# EAGLE schematic Sensor_Stick_half_hw (EAGLE 9.6.2)
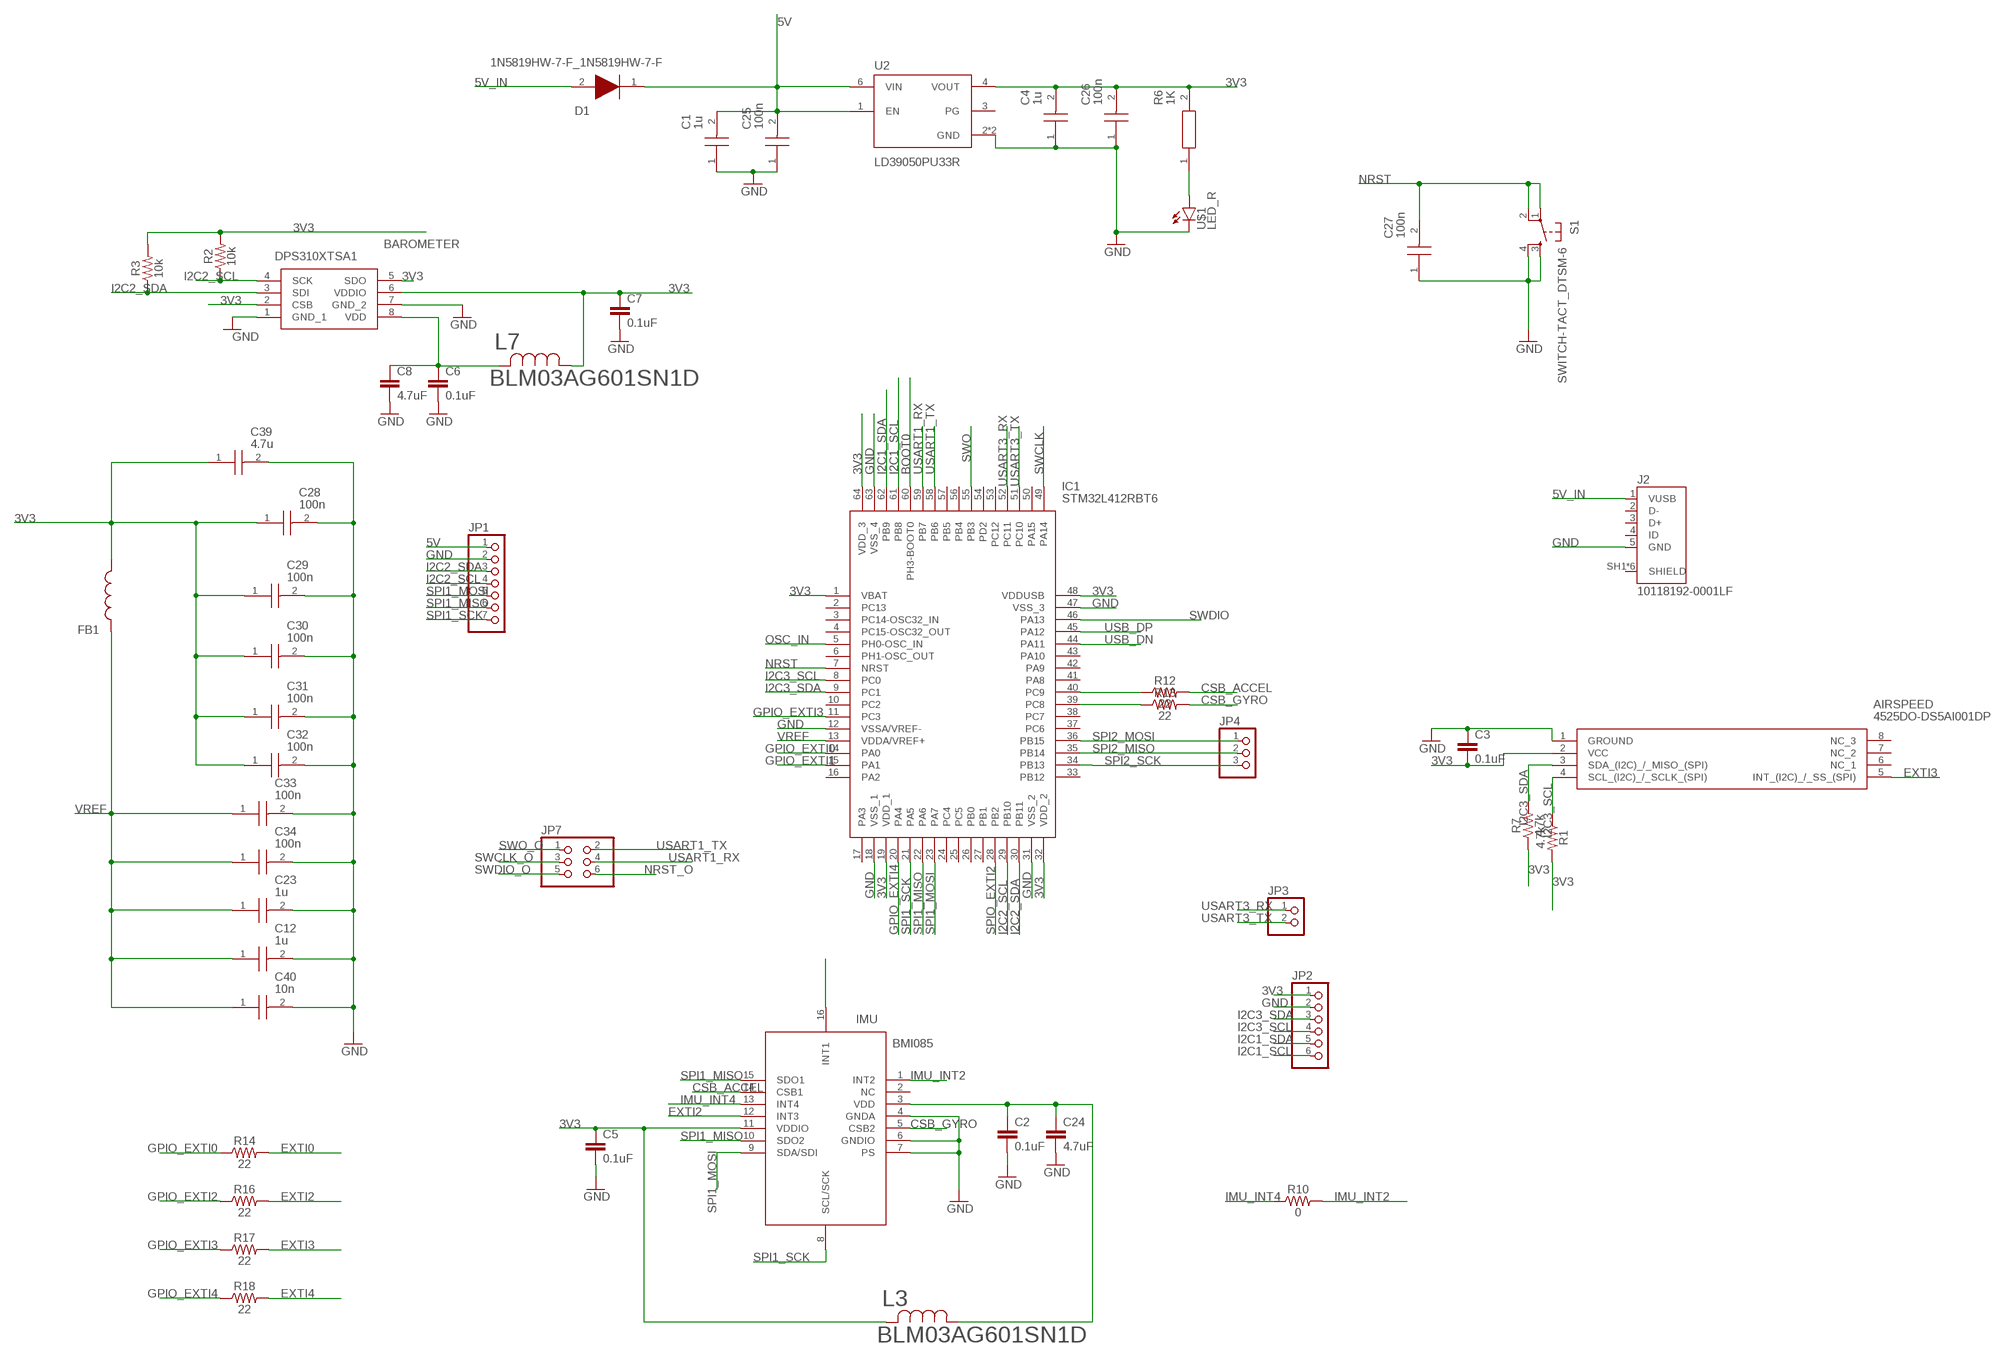
[diagram p0: schematic, sheet 1]

## Parts
AIRSPEED  4525DO-DS5AI001DP  [4525DO-DS...P]
BAROMETER  DPS310XTSA1  [DPS310XTSA1]
C1  1u  GRM219R61H105KA73D  [CAPC2012X95N]
C2  0.1uF  0.1UF-0402-6.3V-10%-X7R  [0402]
C3  0.1uF  0.1UF-0402-6.3V-10%-X7R  [0402]
C4  1u  GRM219R61H105KA73D  [CAPC2012X95N]
C5  0.1uF  0.1UF-0402-6.3V-10%-X7R  [0402]
C6  0.1uF  0.1UF-0402-6.3V-10%-X7R  [0402]
C7  0.1uF  0.1UF-0402-6.3V-10%-X7R  [0402]
C8  4.7uF  4.7UF0603  [0603]
C12  1u  GRM219R61H105KA73D  [CAPC2012X95N]
C23  1u  GRM219R61H105KA73D  [CAPC2012X95N]
C24  4.7uF  4.7UF0603  [0603]
C25  100n  GRT31C5C2A104JA12L  [CAPC3216X180N]
C26  100n  GRT31C5C2A104JA12L  [CAPC3216X180N]
C27  100n  GRT31C5C2A104JA12L  [CAPC3216X180N]
C28  100n  GRT31C5C2A104JA12L  [CAPC3216X180N]
C29  100n  GRT31C5C2A104JA12L  [CAPC3216X180N]
C30  100n  GRT31C5C2A104JA12L  [CAPC3216X180N]
C31  100n  GRT31C5C2A104JA12L  [CAPC3216X180N]
C32  100n  GRT31C5C2A104JA12L  [CAPC3216X180N]
C33  100n  GRT31C5C2A104JA12L  [CAPC3216X180N]
C34  100n  GRT31C5C2A104JA12L  [CAPC3216X180N]
C39  4.7u  GRT21BC71H475KE13L  [CAPC2012X145N]
C40  10n  GRM31CR73A103KW03L  [CAPC3216X180N]
D1  1N5819HW-7-F_1N5819HW-7-F  [1N5819HW-7-F_SOD3716X145N]
FB1  BK1608HS601-T  [BEADC1608X95N]
IC1  STM32L412RBT6  STM32L412RBT6P  [QFP50P1200X1200X160-64N]
IMU  BMI085  [BMI085]
J2  10118192-0001LF  [AMPHENOL_10118192-0001LF]
JP1  PINHD-1X7  [1X07]
JP2  PINHD-1X6  [1X06]
JP3  PINHD-1X2  [1X02]
JP4  PINHD-1X3  [1X03]
JP7  PINHD-2X3  [2X03]
L3  BLM03AG601SN1D  [IND_BLM03_0201_MUR]
L7  BLM03AG601SN1D  [IND_BLM03_0201_MUR]
R1  4.7k  4.7KOHM-0603-1/10W-1%  [0603]
R2  10k  10KOHM-0402-1/16W-1%  [0402]
R3  10k  10KOHM-0402-1/16W-1%  [0402]
R6  1K  RC0805FR-131KL  [RESC2012X60N]
R7  4.7k  4.7KOHM-0603-1/10W-1%  [0603]
R10  0  0OHM-0603-1/10W-5%  [0603]
R12  22  22OHM-0402-1/10W-1%  [0402]
R13  22  22OHM-0402-1/10W-1%  [0402]
R14  22  22OHM-0402-1/10W-1%  [0402]
R16  22  22OHM-0402-1/10W-1%  [0402]
R17  22  22OHM-0402-1/10W-1%  [0402]
R18  22  22OHM-0402-1/10W-1%  [0402]
S1  SWITCH-TACT_DTSM-6  [SWITCH-TACT_DTSM-6]
U2  LD39050PU33R  [SON95P300X300X100-7N]
U$1  LED_R  SML-P12VTT86  [LED_SML-P11UTT86R]

## Nets
3V3: AIRSPEED.2(VCC) BAROMETER.2(CSB) BAROMETER.5(SDO) BAROMETER.6(VDDIO) C3.2 C4.2 C5.1 C7.1 C26.2 C28.1 C29.1 C30.1 C31.1 C32.1 C39.1 FB1.2 IC1.1(VBAT) IC1.19(VDD_1) IC1.32(VDD_2) IC1.48(VDDUSB) IC1.64(VDD_3) IMU.11(VDDIO) JP2.1 L3.2 L7.1 R1.2 R2.2 R3.2 R6.2 R7.1 U2.4(VOUT)
5V: C1.2 C25.2 D1.1(K) JP1.1 U2.1(EN) U2.6(VIN)
5V_IN: D1.2(A) J2.1(VUSB)
BOOT0: IC1.60(PH3-BOOT0)
CSB_ACCEL: IMU.14(CSB1) R12.2
CSB_GYRO: IMU.5(CSB2) R13.2
EXTI0: IMU.16(INT1) R14.2
EXTI2: IMU.12(INT3) R16.2
EXTI3: AIRSPEED.5(INT_(I2C)_/_SS_(SPI)) R17.2
EXTI4: R18.2
GND: AIRSPEED.1(GROUND) BAROMETER.1(GND_1) BAROMETER.7(GND_2) C1.1 C2.2 C3.1 C4.1 C5.2 C6.2 C7.2 C8.2 C12.2 C23.2 C24.2 C25.1 C26.1 C27.1 C28.2 C29.2 C30.2 C31.2 C32.2 C33.2 C34.2 C39.2 C40.2 IC1.12(VSSA/VREF-) IC1.18(VSS_1) IC1.31(VSS_2) IC1.47(VSS_3) IC1.63(VSS_4) IMU.4(GNDA) IMU.6(GNDIO) IMU.7(PS) J2.5(GND) JP1.2 JP2.2 S1.3 S1.4 U2.2(GND) U2.7(GND) U$1.C
GPIO_EXTI0: IC1.14(PA0) R14.1
GPIO_EXTI1: IC1.15(PA1)
GPIO_EXTI2: R16.1
GPIO_EXTI3: IC1.11(PC3) R17.1
GPIO_EXTI4: IC1.20(PA4) R18.1
I2C1_SCL: IC1.61(PB8) JP2.6
I2C1_SDA: IC1.62(PB9) JP2.5
I2C2_SCL: BAROMETER.4(SCK) IC1.29(PB10) JP1.4 R2.1
I2C2_SDA: BAROMETER.3(SDI) IC1.30(PB11) JP1.3 R3.1
I2C3_SCL: AIRSPEED.4(SCL_(I2C)_/_SCLK_(SPI)) IC1.8(PC0) JP2.4 R1.1
I2C3_SDA: AIRSPEED.3(SDA_(I2C)_/_MISO_(SPI)) IC1.9(PC1) JP2.3 R7.2
IMU_INT2: IMU.1(INT2) R10.2
IMU_INT4: IMU.13(INT4) R10.1
N$1: IC1.39(PC8) R13.1
N$2: IC1.40(PC9) R12.1
N$5: R6.1 U$1.A
N$6: BAROMETER.8(VDD) C6.1 C8.1 L7.2
N$8: C2.1 C24.1 IMU.3(VDD) L3.1
NRST: C27.2 IC1.7(NRST) S1.1 S1.2
NRST_O: JP7.6
OSC_IN: IC1.5(PH0-OSC_IN)
SPI1_MISO: IC1.22(PA6) IMU.10(SDO2) IMU.15(SDO1) JP1.6
SPI1_MOSI: IC1.23(PA7) IMU.9(SDA/SDI) JP1.5
SPI1_SCK: IC1.21(PA5) IMU.8(SCL/SCK) JP1.7
SPI2_MISO: IC1.35(PB14) JP4.2
SPI2_MOSI: IC1.36(PB15) JP4.1
SPI2_SCK: IC1.34(PB13) JP4.3
SPIO_EXTI2: IC1.28(PB2)
SWCLK: IC1.49(PA14)
SWCLK_O: JP7.3
SWDIO: IC1.46(PA13)
SWDIO_O: JP7.5
SWO: IC1.55(PB3)
SWO_O: JP7.1
USART1_RX: IC1.59(PB7) JP7.4
USART1_TX: IC1.58(PB6) JP7.2
USART3_RX: IC1.52(PC11) JP3.1
USART3_TX: IC1.51(PC10) JP3.2
USB_DN: IC1.44(PA11)
USB_DP: IC1.45(PA12)
VREF: C12.1 C23.1 C33.1 C34.1 C40.1 FB1.1 IC1.13(VDDA/VREF+)
Unconnected: AIRSPEED.6(NC_1) AIRSPEED.7(NC_2) AIRSPEED.8(NC_3) IC1.2(PC13) IC1.3(PC14-OSC32_IN) IC1.4(PC15-OSC32_OUT) IC1.6(PH1-OSC_OUT) IC1.10(PC2) IC1.16(PA2) IC1.17(PA3) IC1.24(PC4) IC1.25(PC5) IC1.26(PB0) IC1.27(PB1) IC1.33(PB12) IC1.37(PC6) IC1.38(PC7) IC1.41(PA8) IC1.42(PA9) IC1.43(PA10) IC1.50(PA15) IC1.53(PC12) IC1.54(PD2) IC1.56(PB4) IC1.57(PB5) IMU.2(NC) J2.2(D-) J2.3(D+) J2.4(ID) J2.SH1(SHIELD) J2.SH2(SHIELD) J2.SH3(SHIELD) J2.SH4(SHIELD) J2.SH5(SHIELD) J2.SH6(SHIELD) U2.3(PG)

## Library data of the parts
AIRSPEED = 4525DO-DS5AI001DP:4525DO-DS5AI001DP: Differential Pressure Sensor 1PSI Dual Barbs Source: Datasheet <http://www.te.com/commerce/DocumentDelivery/DDEController?Action=srchrtrv&DocNm=MS4525DO&DocType=DS&DocLang=English>; ARROW_PART_NUMBER: 4525DO-DS5AI001DP; ARROW_PRICE-STOCK: https://www.arrow.com/en/products/4525do-ds5ai001dp/te-connectivity; DESCRIPTION: Differential Pressure Sensor 1PSI Dual Barbs; HEIGHT: mm; MANUFACTURER_NAME: TE Connectivity; MANUFACTURER_PART_NUMBER: 4525DO-DS5AI001DP; MOUSER_PART_NUMBER: 824-4525DODS5AI001DP; MOUSER_PRICE-STOCK: https://www.mouser.co.uk/ProductDetail/Measurement-Specialties/4525DO-DS5AI001DP?qs=oFx6pF86PmDUpUCTX7loEA%3D%3D
BAROMETER = DPS310XTSA1:DPS310XTSA1: INFINEON - DPS310XTSA1 - DIGITAL PRESSURE SENSOR, 1200HPA, VLGA-8 Source: Datasheet <https://www.infineon.com/dgdl/Infineon-DPS310-DS-v01_00-EN.pdf?fileId=5546d462576f34750157750826c42242>; ARROW_PART_NUMBER: DPS310XTSA1; ARROW_PRICE-STOCK: https://www.arrow.com/en/products/dps310xtsa1/infineon-technologies-ag?region=nac; DESCRIPTION: INFINEON - DPS310XTSA1 - DIGITAL PRESSURE SENSOR, 1200HPA, VLGA-8; HEIGHT: 1.01mm; MANUFACTURER_NAME: Infineon; MANUFACTURER_PART_NUMBER: DPS310XTSA1; MOUSER_PART_NUMBER: 726-DPS310XTSA1; MOUSER_PRICE-STOCK: https://www.mouser.co.uk/ProductDetail/Infineon-Technologies/DPS310XTSA1?qs=uuTTuBTXn66Ynca8WHwycg%3D%3D
C1 C4 C12 C23 = GRM219R61H105KA73D(1u):GRM219R61H105KA73D: MURATA - GRM219R61H105KA73D - CAP, MLCC, X5R, 1UF, 50V, 0805 Source: Datasheet <https://datasheet.datasheetarchive.com/originals/distributors/DKDS-10/191852.pdf>; DESCRIPTION: MURATA - GRM219R61H105KA73D - CAP, MLCC, X5R, 1UF, 50V, 0805; HEIGHT: 0.95mm; MANUFACTURER_NAME: Murata Electronics; MANUFACTURER_PART_NUMBER: GRM219R61H105KA73D; MOUSER_PART_NUMBER: 81-GRM219R61H105KA3D; MOUSER_PRICE-STOCK: https://www.mouser.co.uk/ProductDetail/Murata-Electronics/GRM219R61H105KA73D?qs=O5cugoO6nweiD1nCQ5vS9w%3D%3D
C2 C5-C7 = SparkFun-Capacitors:0.1UF: 0.1µF ceramic capacitors A capacitor is a passive two-terminal electrical component used to store electrical energy temporarily in an electric field.; PROD_ID: CAP-14993
C3 = SparkFun-Capacitors:0.1UF: 0.1µF ceramic capacitors A capacitor is a passive two-terminal electrical component used to store electrical energy temporarily in an electric field.; PROD_ID: CAP-14993; SPICEPREFIX: C
C8 C24 = SparkFun-Capacitors:4.7UF: 4.7µF ceramic capacitors A capacitor is a passive two-terminal electrical component used to store electrical energy temporarily in an electric field.; PROD_ID: CAP-08280
C25-C34 = GRT31C5C2A104JA12L(0_1u):GRT31C5C2A104JA12L: Multilayer Ceramic Capacitors MLCC - SMD/SMT Source: Datasheet <https://www.murata.com/en-eu/products/productdetail?partno=GRT31C5C2A104JA12#>; DESCRIPTION: Multilayer Ceramic Capacitors MLCC - SMD/SMT; HEIGHT: 1.8mm; MANUFACTURER_NAME: Murata Electronics; MANUFACTURER_PART_NUMBER: GRT31C5C2A104JA12L; MOUSER_PART_NUMBER: 81-GRT31C5C2A104JA2L; MOUSER_PRICE-STOCK: https://www.mouser.co.uk/ProductDetail/Murata-Electronics/GRT31C5C2A104JA12L?qs=rI7uf1IzohSpYGEFBFd58g%3D%3D
C39 = GRT21BC71H475KE13L(4_7u):GRT21BC71H475KE13L: GRT21BC71H475KE13_ (0805, X7S:EIA, 4.7uF, DC50V) Source: Datasheet <https://search.murata.co.jp/Ceramy/image/img/A01X/G101/ENG/GRT21BC71H475KE13-01.pdf>; DESCRIPTION: GRT21BC71H475KE13_ (0805, X7S:EIA, 4.7uF, DC50V); HEIGHT: 1.45mm; MANUFACTURER_NAME: Murata Electronics; MANUFACTURER_PART_NUMBER: GRT21BC71H475KE13L; MOUSER_PART_NUMBER: 81-GRT21BC71H475KE3L; MOUSER_PRICE-STOCK: https://www.mouser.co.uk/ProductDetail/Murata-Electronics/GRT21BC71H475KE13L?qs=rI7uf1IzohQrtwc9u30k7A%3D%3D
C40 = GRM31CR73A103KW03L(0_01u):GRM31CR73A103KW03L: Murata 3216 GRM 10000pF Ceramic Multilayer Capacitor, 1000 V dc, +125C, X7R Dielectric, +/-10% Source: Datasheet <https://datasheet.datasheetarchive.com/originals/distributors/DKDS-10/192419.pdf>; DESCRIPTION: Murata 3216 GRM 10000pF Ceramic Multilayer Capacitor, 1000 V dc, +125C, X7R Dielectric, +/-10%; HEIGHT: 1.8mm; MANUFACTURER_NAME: Murata Electronics; MANUFACTURER_PART_NUMBER: GRM31CR73A103KW03L; MOUSER_PART_NUMBER: 81-GRM31CR73A103KW3L; MOUSER_PRICE-STOCK: https://www.mouser.co.uk/ProductDetail/Murata-Electronics/GRM31CR73A103KW03L?qs=hNud%2FORuBR1TymPCs4fJcA%3D%3D
D1 = ce-capstone-2022:1N5819HW-7-F_1N5819HW-7-F: Diode Schottky 1A 40V SOD123 Diodes Inc 1N5819HW-7-F, SMT Schottky Diode, 40V 1A, 2-Pin SOD-123 Source: Datasheet <https://datasheet.datasheetarchive.com/originals/distributors/Datasheets-DGA23/1390892.pdf>; ARROW_PART_NUMBER: 1N5819HW-7-F; ARROW_PRICE-STOCK: https://www.arrow.com/en/products/1n5819hw-7-f/diodes-incorporated; DESCRIPTION: Diode Schottky 1A 40V SOD123 Diodes Inc 1N5819HW-7-F, SMT Schottky Diode, 40V 1A, 2-Pin SOD-123; HEIGHT: 1.45mm; MANUFACTURER_NAME: Diodes Inc.; MANUFACTURER_PART_NUMBER: 1N5819HW-7-F; MOUSER_PART_NUMBER: 621-1N5819HW-F; MOUSER_PRICE-STOCK: https://www.mouser.co.uk/ProductDetail/Diodes-Incorporated/1N5819HW-7-F?qs=NQ47qNm99eDyWTEd07miYA%3D%3D
FB1 = ce-capstone:BK1608HS601-T: Ferrite Chip Bead(Lead Free) Source: Datasheet <https://www.tai-tech.com.tw/_upload/files/FCM1608-Series.pdf>; DESCRIPTION: Ferrite Chip Bead(Lead Free); HEIGHT: 0.95mm; MANUFACTURER_NAME: Taiyo Yuden; MANUFACTURER_PART_NUMBER: BK1608HS601-T
IC1 = STM32L412RBT6P:STM32L412RBT6P: ARM Microcontrollers - MCU Source: Datasheet <https://www.st.com/resource/en/datasheet/stm32l412c8.pdf>; DESCRIPTION: ARM Microcontrollers - MCU; HEIGHT: 1.6mm; MANUFACTURER_NAME: STMicroelectronics; MANUFACTURER_PART_NUMBER: STM32L412RBT6P; MOUSER_PART_NUMBER: 511-STM32L412RBT6P; MOUSER_PRICE-STOCK: https://www.mouser.co.uk/ProductDetail/STMicroelectronics/STM32L412RBT6P?qs=l7cgNqFNU1hh%252BU1wOZs5Xg%3D%3D
IMU = BMI085:BMI085: IMUs - Inertial Measurement Units High-performance IMU BMI085 for virtual and augmented reality applications Source: Datasheet <https://ae-bst.resource.bosch.com/media/_tech/media/datasheets/BST-BMI085-DS001.pdf>; ARROW_PART_NUMBER: BMI085; ARROW_PRICE-STOCK: https://www.arrow.com/en/products/bmi085/bosch; DESCRIPTION: IMUs - Inertial Measurement Units High-performance IMU BMI085 for virtual and augmented reality applications; HEIGHT: 1mm; MANUFACTURER_NAME: Bosch Sensortec; MANUFACTURER_PART_NUMBER: BMI085; MOUSER_PART_NUMBER: 262-BMI085; MOUSER_PRICE-STOCK: https://www.mouser.co.uk/ProductDetail/Bosch-Sensortec/BMI085?qs=y6ZabgHbY%252ByGCM8LfWZyqA%3D%3D
J2 = ce-capstone:10118192-0001LF: Single Port 5 Contact Horizontal Right Angle Shielded Micro B USB 2.0 Connector; AVAILABILITY: Unavailable; DESCRIPTION: USB - micro B USB 2.0 Receptacle Connector 5 Position Surface Mount, Right Angle; MF: Amphenol ICC; MP: 10118192-0001LF; PACKAGE: None; PRICE: None
JP1 = pinhead:PINHD-1X7: PIN HEADER
JP2 = pinhead:PINHD-1X6: PIN HEADER
JP3 = pinhead:PINHD-1X2: PIN HEADER
JP4 = pinhead:PINHD-1X3: PIN HEADER
JP7 = pinhead:PINHD-2X3: PIN HEADER
L3 L7 = BLM03AG601SN1D:BLM03AG601SN1D; COPYRIGHT: Copyright (C) 2023 Ultra Librarian. All rights reserved.; DIGI-KEY_PART_NUMBER_1: 490-5164-1-ND; DIGI-KEY_PART_NUMBER_2: 490-5164-2-ND; DIGI-KEY_PART_NUMBER_3: 490-5164-6-ND; MANUFACTURER_PART_NUMBER: BLM03AG601SN1D; MFR_NAME: Murata
R1 R7 = SparkFun-Resistors:4.7KOHM: 4.7kΩ resistor A resistor is a passive two-terminal electrical component that implements electrical resistance as a circuit element. Resistors act to reduce current flow, and, at the same time, act to lower voltage levels within circuits. - Wikipedia; PROD_ID: RES-07857
R2 R3 = SparkFun-Resistors:10KOHM: 10kΩ resistor A resistor is a passive two-terminal electrical component that implements electrical resistance as a circuit element. Resistors act to reduce current flow, and, at the same time, act to lower voltage levels within circuits. - Wikipedia; PROD_ID: RES-14241
R6 = RC0805FR-131KL:RC0805FR-131KL: Thick Film Resistors - SMD 1 kOhms 250 mW 0805 1% Source: Datasheet <https://datasheet.datasheetarchive.com/originals/distributors/Datasheets_SAMA/902f9e387b938f871d31120f5fc1d65e.pdf>; DESCRIPTION: Thick Film Resistors - SMD 1 kOhms 250 mW 0805 1%; HEIGHT: 0.6mm; MANUFACTURER_NAME: KEMET; MANUFACTURER_PART_NUMBER: RC0805FR-131KL; MOUSER_PART_NUMBER: 603-RC0805FR-131KL; MOUSER_PRICE-STOCK: https://www.mouser.co.uk/ProductDetail/YAGEO/RC0805FR-131KL?qs=m6lXFsvg5e0qJLgmV7HC3Q%3D%3D
R10 = SparkFun-Resistors:0OHM: 0Ω resistor A resistor is a passive two-terminal electrical component that implements electrical resistance as a circuit element. Resistors act to reduce current flow, and, at the same time, act to lower voltage levels within circuits. - Wikipedia; PROD_ID: RES-08609
R12-R14 R16-R18 = SparkFun-Resistors:22OHM: 22Ω resistor A resistor is a passive two-terminal electrical component that implements electrical resistance as a circuit element. Resistors act to reduce current flow, and, at the same time, act to lower voltage levels within circuits. - Wikipedia; PROD_ID: RES-12427
S1 = ce-capstone-2022:SWITCH-TACT_DTSM-6
U2 = ce-capstone:LD39050PU33R: LD39050 Series 500 mA 3.3 V Fixed Low Noise LDO Voltage Regulator - DFN-6; AVAILABILITY: Unavailable; DESCRIPTION: Linear Voltage Regulator IC 1 Output 500mA 6-DFN _3x3_; MF: STMicroelectronics; MP: LD39050PU33R; PACKAGE: DFN-6 STMicroelectronics; PRICE: None
U$1 = ce-capstone:SML-P12VTT86: SML-P1 Series Red 0402 Clear 60 mcd 2 V Surface Mount PICOLED LED; AVAILABILITY: Unavailable; DESCRIPTION: Red 630nm LED Indication - Discrete 2V 0402 _1006 Metric_; MF: Rohm; MP: SML-P12VTT86; PACKAGE: 0402 Rohm; PRICE: None